# EAGLE design DS2482_shield (EAGLE 6.2)
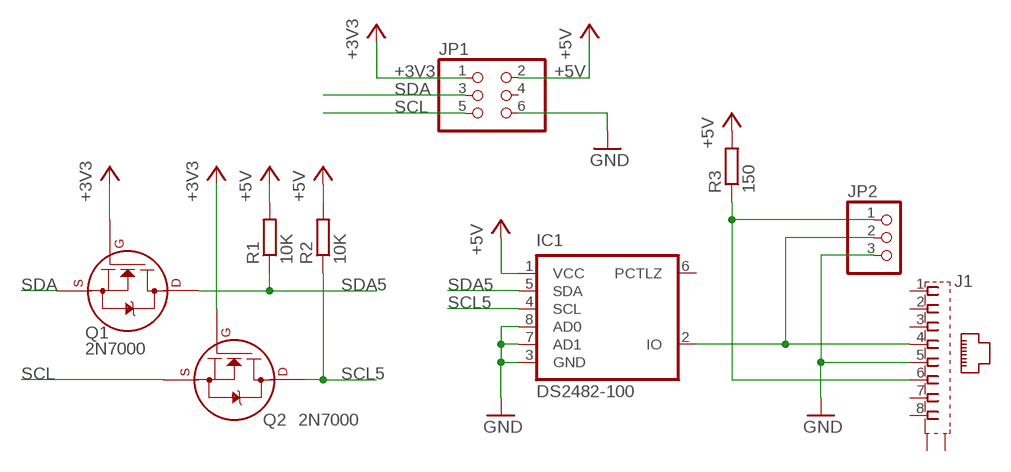
[diagram p0: schematic, sheet 1]

## Parts
IC1  DS2482-100  [SO08]
J1  555153-1  [555153-1]
JP1  PINHD-2X3  [2X03]
JP2  PINHD-1X3  [1X03]
Q1  2N7000  2N700_TO92-  [TO92-]
Q2  2N7000  2N700_TO92-  [TO92-]
R1  10K  R-EU_0204/7  [0204/7]
R2  10K  R-EU_0204/7  [0204/7]
R3  150  R-EU_0204/7  [0204/7]

## Nets
+3V3: JP1.1 Q1.2(G) Q2.2(G)
+5V: IC1.1(VCC) JP1.2 R1.2 R2.2 R3.2
GND: IC1.3(GND) IC1.7(AD1) IC1.8(AD0) J1.5 JP1.6 JP2.3
N$1: J1.6 JP2.1 R3.1
ONEWIRE: IC1.2(IO) J1.4 JP2.2
SCL: JP1.5 Q2.3(S)
SCL5: IC1.4(SCL) Q2.1(D) R2.1
SDA: JP1.3 Q1.3(S)
SDA5: IC1.5(SDA) Q1.1(D) R1.1
Unconnected: IC1.6(PCTLZ) J1.1 J1.2 J1.3 J1.7 J1.8 J1.G1(S1) J1.G2(S2) JP1.4

## Library data of the parts
IC1 = parts:DS2482-100: Single channel 1-Wire master with I2C interface
J1 = con-amp:555153-1: AMP connector
JP1 = pinhead:PINHD-2X3: PIN HEADER
JP2 = pinhead:PINHD-1X3: PIN HEADER
Q1 Q2 = myparts:2N700*: 2N7000, 2N7002, NDS7002A N-channel enhancement mode MOSFET
R1-R3 = rcl:R-EU_: RESISTOR, European symbol

## Board
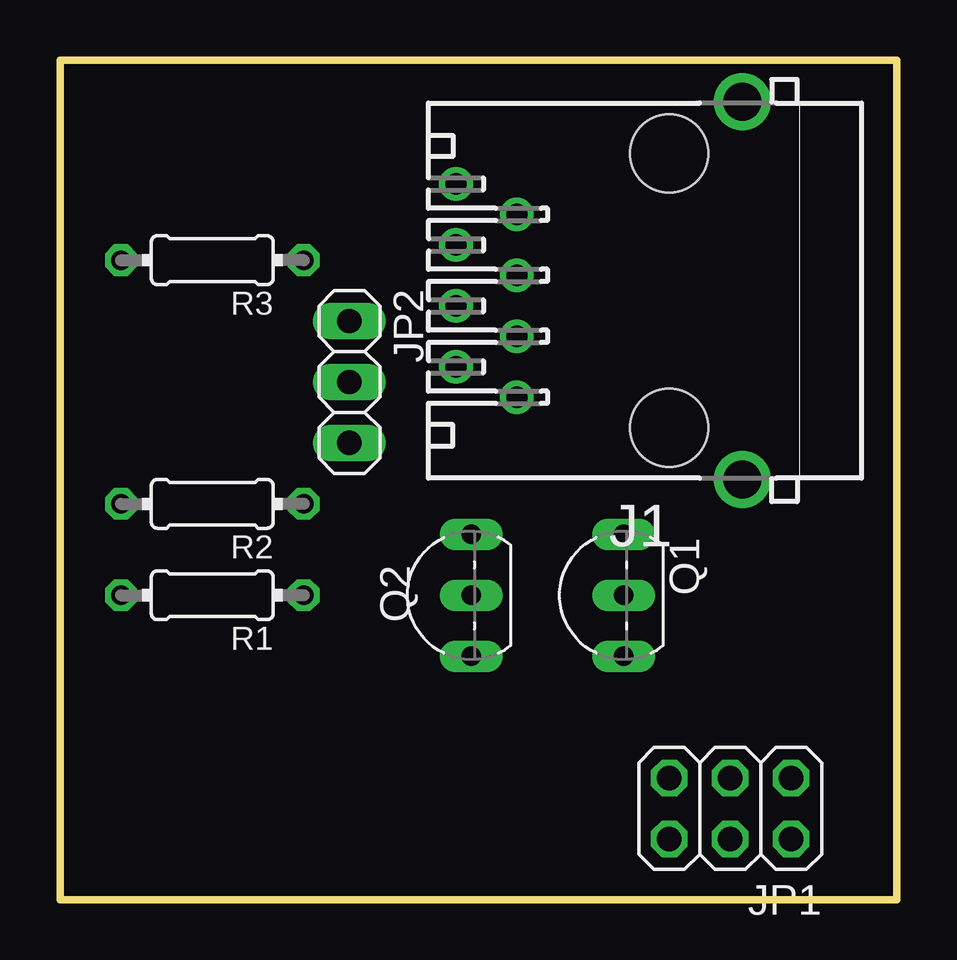
[diagram p1: board, top side]
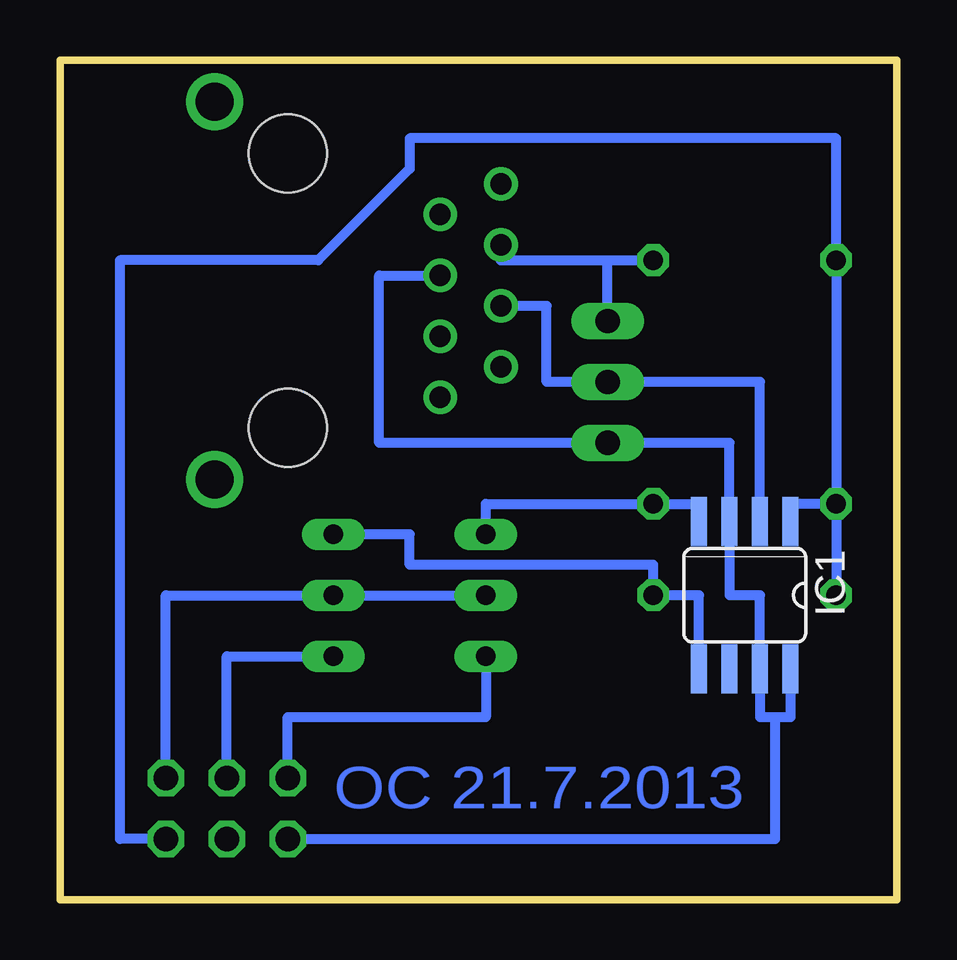
[diagram p2: board, bottom side, seen from below]

Size 34.9 x 35.02 mm. Coordinates in mm from the lower left corner, seen from the top.
Outline: 0,0 34.9,0 34.9,35.02 0,35.02 0,0
Copper layers (1*16): Top 0.035mm / dielectric 1.5mm / Bottom 0.035mm
Design rules "default": minimum track width 10mil, minimum drill 24mil, track to track 8mil, track to pad 8mil, pad to pad 8mil, via to via 8mil, smd to smd 8mil, copper to edge 40mil, drill to drill 8mil, minimum pad ring 10mil, minimum via ring 8mil, stop-mask expansion 4mil, vias tented up to drill 0mil, thermal gap 10mil

### Footprints (pad centres in the part's own frame; a part is rotated, then mirrored left to right if it is on the bottom)
SO08 = smd 0.66 x 2.032: 1 -1.905,-3.073; 2 -0.635,-3.073; 3 0.635,-3.073; 4 1.905,-3.073; 5 1.905,3.073; 6 0.635,3.073; 7 -0.635,3.073; 8 -1.905,3.073
555153-1 = drill 0.889: 1 -4.445,6.35; 2 -3.175,8.89; 3 -1.905,6.35; 4 -0.635,8.89; 5 0.635,6.35; 6 1.905,8.89; 7 3.175,6.35; 8 4.445,8.89 | drill 1.575 pad 2.184: G1 -7.874,-3.048; G2 7.874,-3.048 | hole 3.251: -5.715,0; 5.715,0
2X03 = drill 1.016 octagon: 1 -2.54,-1.27; 2 -2.54,1.27; 3 0,-1.27; 4 0,1.27; 5 2.54,-1.27; 6 2.54,1.27
1X03 = drill 1.016 long: 1 -2.54,0; 2 0,0; 3 2.54,0
TO92- = drill 0.813 long: 1 2.54,0; 2 0,0; 3 -2.54,0
0204/7 = drill 0.813 octagon: 1 -3.81,0; 2 3.81,0

### Placement (x,y rotation side)
IC1  6.35,12.7 180 bottom
J1  25.4,25.4 90 top
JP1  27.94,3.81 180 top
JP2  12.06,21.59 270 top
Q1  23.5,12.7 90 top
Q2  17.14,12.7 90 top
R1  6.35,12.7 180 top
R2  6.35,16.51 180 top
R3  6.35,26.67 180 top

### Tracks (layer width: path | path; a pad name or v marks a point on that pad's centre or on a via)
+3V3
  Bottom 0.406: Q2.2 Q1.2 30.48,12.7 JP1.1
+5V
  Bottom 0.406: R2.2 R1.2 | R2.2 4.45,16.51 IC1.1 | JP1.2 32.38,2.54 32.38,26.67 24.13,26.67 20.32,30.48 20.32,31.75 2.54,31.75 R3.2 R2.2
GND
  Bottom 0.406: IC1.8 4.45,7.62 5.08,7.62 | 5.08,7.62 5.71,7.62 IC1.7 5.71,12.7 6.99,12.7 IC1.3 6.99,19.05 JP2.3 21.59,19.05 21.59,26.04 J1.5 | JP1.6 5.08,2.54 5.08,7.62
N$1
  Bottom 0.406: J1.6 16.51,26.67 12.06,26.67 | 12.06,26.67 R3.1 | JP2.1 12.06,26.67
ONEWIRE
  Bottom 0.406: IC1.2 5.71,21.59 JP2.2 14.61,21.59 14.61,24.77 J1.4
SCL
  Bottom 0.406: Q2.3 17.14,7.62 25.4,7.62 JP1.5
SCL5
  Bottom 0.406: Q2.1 17.14,16.51 R2.1 8.26,16.51 IC1.4
SDA
  Bottom 0.406: Q1.3 27.94,10.16 JP1.3
SDA5
  Bottom 0.406: IC1.5 8.26,12.7 R1.1 10.16,13.97 20.32,13.97 20.32,15.24 Q1.1

### Text on the board
Bottom: OC 21.7.2013